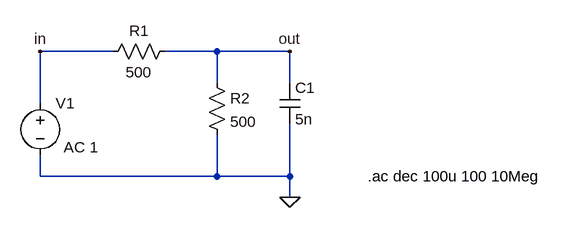
[diagram p0: schematic rc[01].asc]
rc[01].asc, the LTspice schematic file:
Version 4
SHEET 1 880 680
WIRE 192 16 80 16
WIRE 352 16 272 16
WIRE 464 16 352 16
WIRE 352 64 352 16
WIRE 464 64 464 16
WIRE 80 96 80 16
WIRE 80 208 80 176
WIRE 352 208 352 144
WIRE 352 208 80 208
WIRE 464 208 464 128
WIRE 464 208 352 208
WIRE 464 240 464 208
FLAG 464 240 0
FLAG 80 16 in
FLAG 464 16 out
SYMBOL res 288 0 R90
WINDOW 0 0 56 VBottom 2
WINDOW 3 32 56 VTop 2
SYMATTR InstName R1
SYMATTR Value 500
SYMBOL cap 448 64 R0
SYMATTR InstName C1
SYMATTR Value 5n
SYMBOL voltage 80 80 R0
WINDOW 123 36 83 Left 2
WINDOW 39 0 0 Left 2
SYMATTR Value2 AC 1
SYMATTR Value ""
SYMATTR InstName V1
SYMBOL res 336 48 R0
SYMATTR InstName R2
SYMATTR Value 500
TEXT 584 208 Left 2 !.ac dec 100u 100 10Meg

The netlist it stands for:
* rc[01].asc
R1 out in 500
C1 out 0 5n
V1 in 0 AC 1
R2 out 0 500
.ac dec 100u 100 10Meg
.backanno
.end